# Altium schematic sheet buzzer.SchDoc
size A
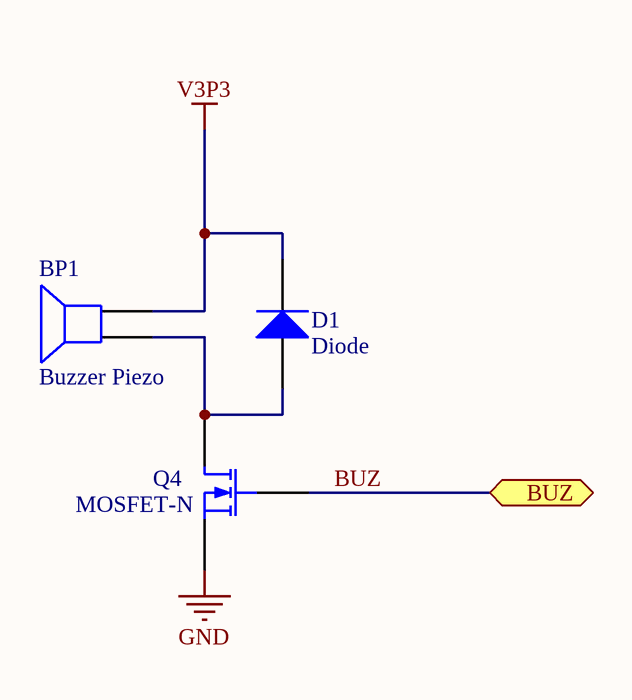
[diagram p0: buzzer.SchDoc]

## Parts
BP1  Buzzer Piezo  [BUZZER]
D1  Diode  [PONT REDRESSEUR]
Q4  MOSFET-N  [MOSFET]

## Ports
BUZ (bidir)

## Nets
GND: Q4.3(S)
V3P3: BP1.2 D1.2(K)
BUZ: Q4.2(G) ; port BUZ
NetBP1_1: BP1.1 D1.1(A) Q4.1(D)

## Library data of the parts
BP1 = Speaker: Ref. fabricant: KCG0603; Fabricant: Kingstate; Ref. fournisseur: 2215077; Fournisseur: Farnell; Published: 24-Mar-1999; LatestRevisionDate: 17-Jul-2002; LatestRevisionNote: Re-released for DXP Platform.; PackageReference: PIN2; Publisher: Altium Limited
D1 = Diode: Default Diode; Fournisseur: Farnell; Ref. fournisseur: 1467476; Fabricant: FAIRCHILD SEMICONDUCTOR; Ref. fabricant: GF1A; Published: 8-Jun-2000; LatestRevisionDate: 17-Jul-2002; LatestRevisionNote: Re-released for DXP Platform.; PackageVersion: Sep-1996; PackageReference: SMC; Publisher: Altium Limited; PackageDescription: DO-214-AB/SMC; 2 C-Bend Leads; Body 7.9 x 5.9 mm, inc. leads (LxW); Code_JEDEC: DO-214-AB
Q4 = MOSFET-N: N-Channel MOSFET; Fabricant: NXP; Ref. fabricant: 2N7002PW; Fournisseur: Farnell; Ref. fournisseur: 1829184; Published: 8-Jun-2000; LatestRevisionDate: 17-Jul-2002; LatestRevisionNote: Re-released for DXP Platform.; PackageVersion: 1995/1996; PackageReference: E3; Publisher: Altium Limited; PackageDescription: TO, Flat Index; 3 In-Line, Axial Leads; Body Dia. 4.6mm; Lead Dia. 0.5 mm (max)